# Altium project KlusterLab r2.0.PrjPcb (part 2 of 10)

## Sheet DDR3 Memory_Banks 32-33-34.SchDoc
size A3; SheetNumber: 5; SheetTotal: 23
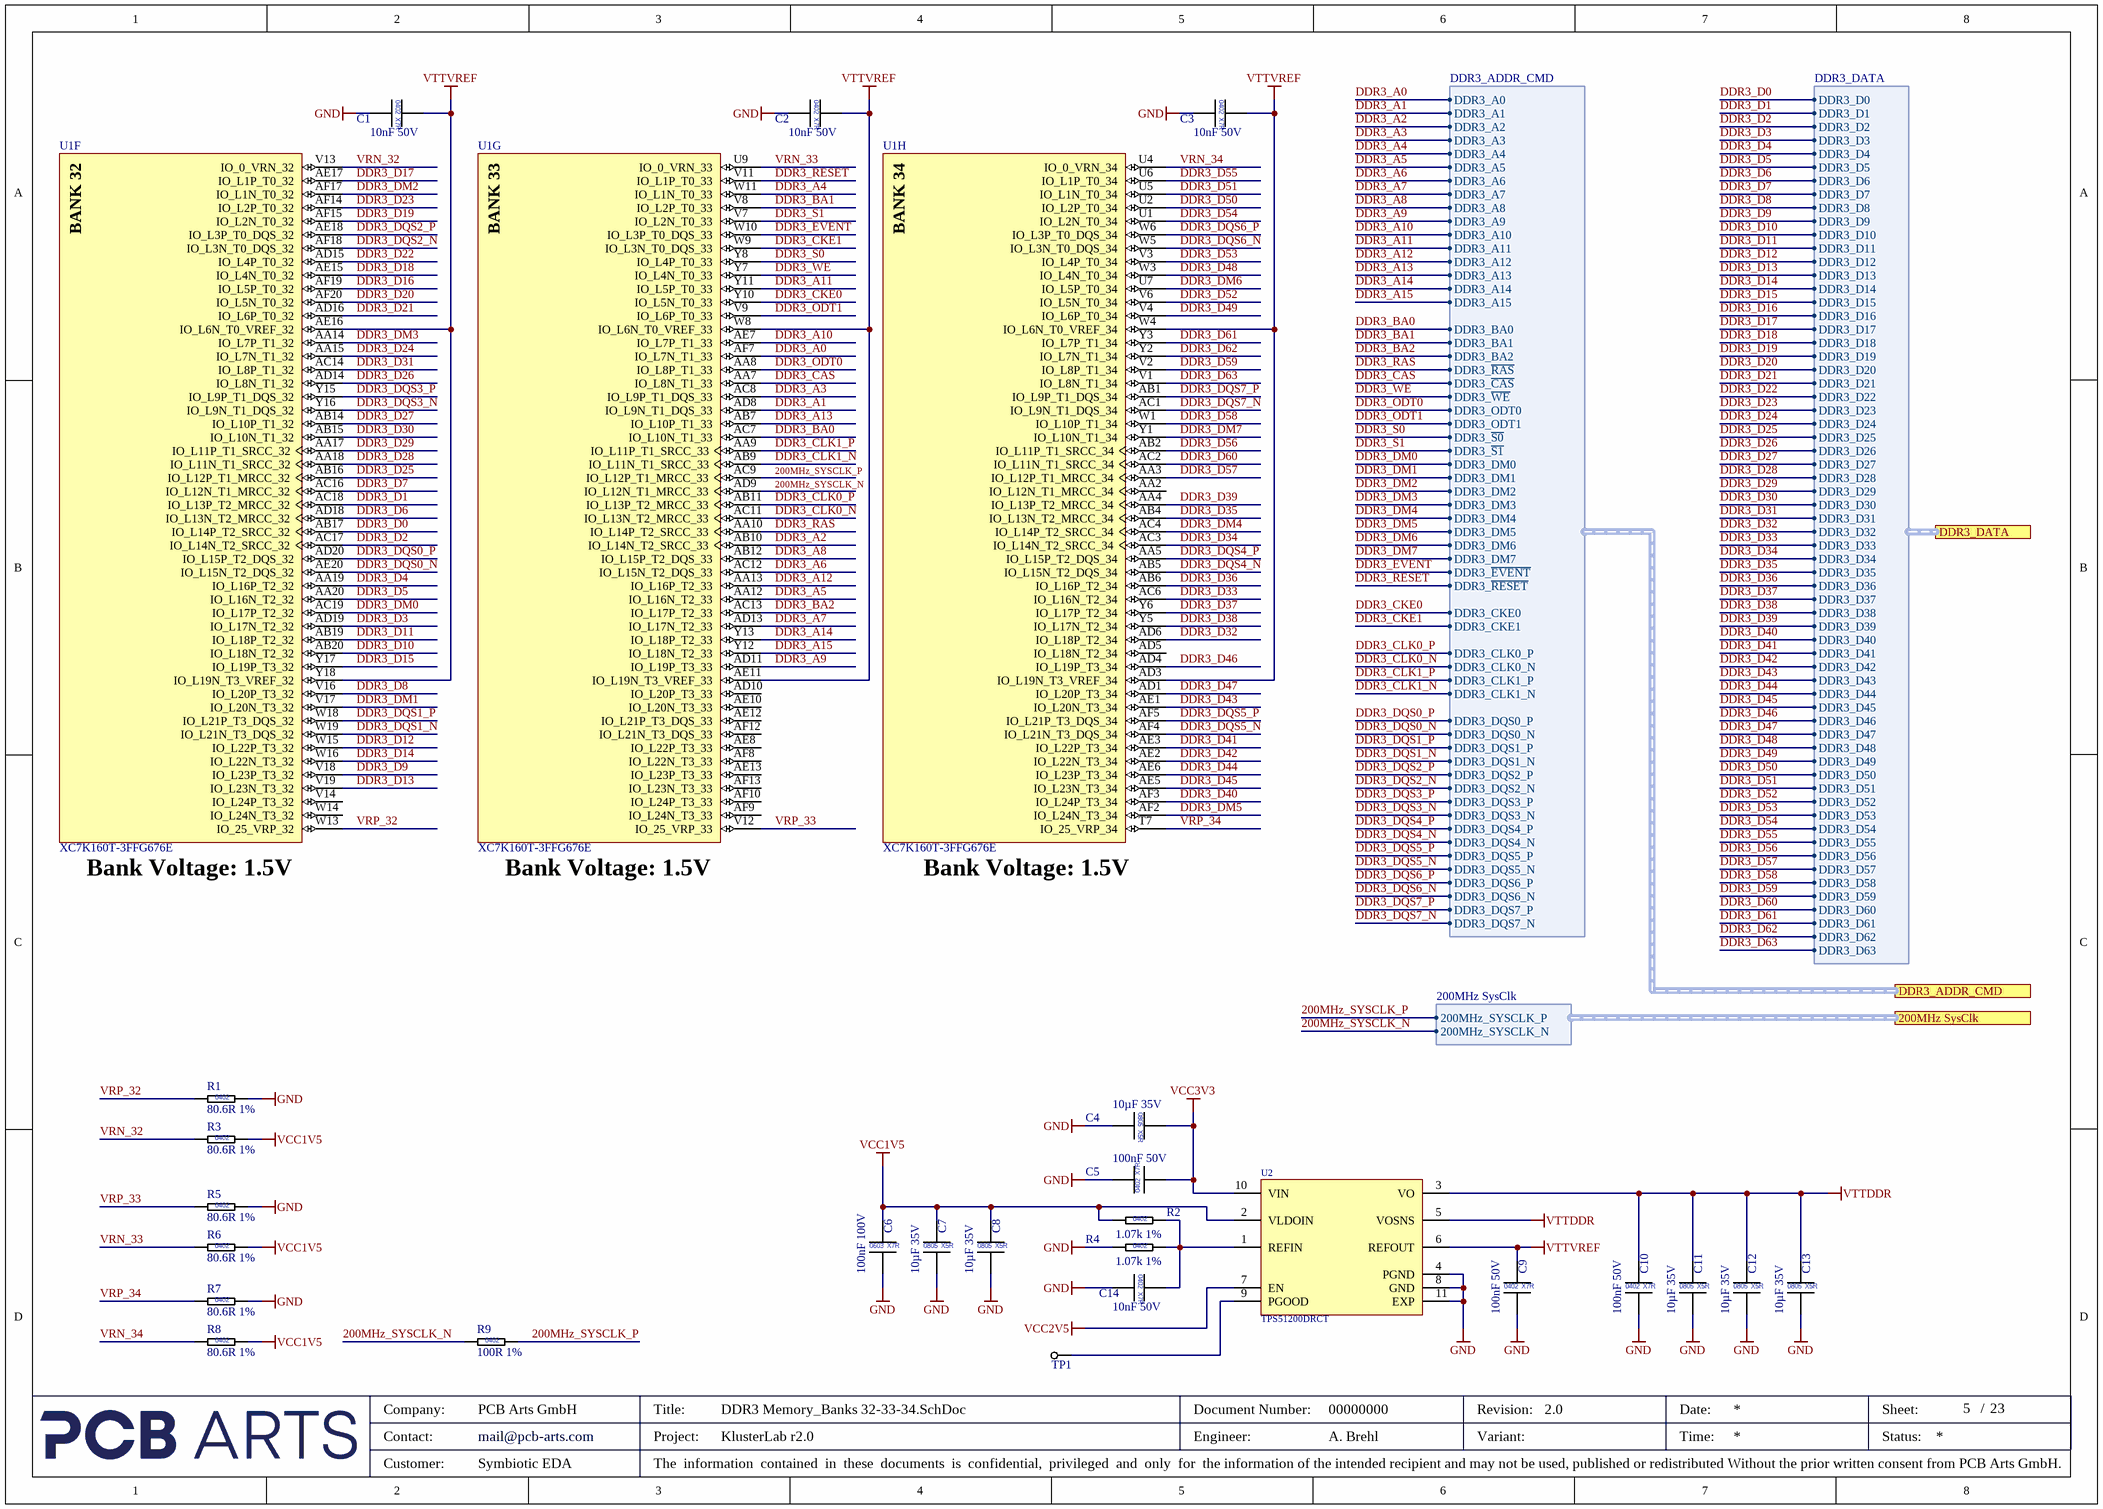
[diagram p3: DDR3 Memory_Banks 32-33-34.SchDoc]

### Parts
C1  10nF 50V  [CAP_0402_L]
C2  10nF 50V  [CAP_0402_L]
C3  10nF 50V  [CAP_0402_L]
C4  10µF 35V  [CAP_0805]
C5  100nF 50V  [CAP_0402_L]
C6  100nF 100V  [CAP_0603_L]
C7  10µF 35V  [CAP_0805]
C8  10µF 35V  [CAP_0805]
C9  100nF 50V  [CAP_0402_L]
C10  100nF 50V  [CAP_0402_L]
C11  10µF 35V  [CAP_0805]
C12  10µF 35V  [CAP_0805]
C13  10µF 35V  [CAP_0805]
C14  10nF 50V  [CAP_0402_L]
R1  80.6R 1%  [RES_0402_L]
R2  1.07k 1%  [RES_0402_L]
R3  80.6R 1%  [RES_0402_L]
R4  1.07k 1%  [RES_0402_L]
R5  80.6R 1%  [RES_0402_L]
R6  80.6R 1%  [RES_0402_L]
R7  80.6R 1%  [RES_0402_L]
R8  80.6R 1%  [RES_0402_L]
R9  100R 1%  [RES_0402_L]
TP1  Testpoint  [Testpoint 0.8mm]  (value not drawn)  (no BOM)
U1  XC7K160T-3FFG676E  [BGA100P2700X2700X317-676N]  (parts F,G,H of 14)
U2  TPS51200DRCT  [QFN50P300X300X100-11N]

### Ports
200MHz SysClk (harness 200MHz SysClk, see Top-Level-Sheet[5B], System Clocks[8A]), DDR3_ADDR_CMD (harness DDR3_ADDR_CMD, see Top-Level-Sheet[5B], DDR3 Memory_SO-DIMM[8C]), DDR3_DATA (harness DDR3_DATA, see Top-Level-Sheet[5B], DDR3 Memory_SO-DIMM[8B])

### Harnesses
DDR3_DATA: DDR3_D0, DDR3_D1, DDR3_D2, DDR3_D3, DDR3_D4, DDR3_D5, DDR3_D6, DDR3_D7, DDR3_D8, DDR3_D9, DDR3_D10, DDR3_D11, DDR3_D12, DDR3_D13, DDR3_D14, DDR3_D15, DDR3_D16, DDR3_D17, DDR3_D18, DDR3_D19, DDR3_D20, DDR3_D21, DDR3_D22, DDR3_D23, DDR3_D24, DDR3_D25, DDR3_D26, DDR3_D27, DDR3_D28, DDR3_D29, DDR3_D30, DDR3_D31, DDR3_D32, DDR3_D33, DDR3_D34, DDR3_D35, DDR3_D36, DDR3_D37, DDR3_D38, DDR3_D39, DDR3_D40, DDR3_D41, DDR3_D42, DDR3_D43, DDR3_D44, DDR3_D45, DDR3_D46, DDR3_D47, DDR3_D48, DDR3_D49, DDR3_D50, DDR3_D51, DDR3_D52, DDR3_D53, DDR3_D54, DDR3_D55, DDR3_D56, DDR3_D57, DDR3_D58, DDR3_D59, DDR3_D60, DDR3_D61, DDR3_D62, DDR3_D63
DDR3_ADDR_CMD: DDR3_A0, DDR3_BA0, DDR3_BA1, DDR3_BA2, DDR3_~{RAS}, DDR3_~{CAS}, DDR3_~{WE}, DDR3_ODT0, DDR3_ODT1, DDR3_~{S0}, DDR3_~{S1}, DDR3_DM0, DDR3_~{EVENT}, DDR3_~{RESET}, DDR3_CKE0, DDR3_CKE1, DDR3_CLK0_P, DDR3_CLK0_N, DDR3_CLK1_P, DDR3_CLK1_N, DDR3_DQS0_P, DDR3_DQS0_N, DDR3_DQS1_P, DDR3_DQS1_N, DDR3_DQS2_P, DDR3_DQS2_N, DDR3_DQS3_P, DDR3_DQS3_N, DDR3_DQS4_P, DDR3_DQS4_N, DDR3_DQS5_P, DDR3_DQS5_N, DDR3_DQS6_P, DDR3_DQS6_N, DDR3_DQS7_P, DDR3_DQS7_N, DDR3_A1, DDR3_A2, DDR3_A3, DDR3_A4, DDR3_A5, DDR3_A6, DDR3_A7, DDR3_A8, DDR3_A9, DDR3_A10, DDR3_A11, DDR3_A12, DDR3_A13, DDR3_A14, DDR3_A15, DDR3_DM1, DDR3_DM2, DDR3_DM3, DDR3_DM4, DDR3_DM5, DDR3_DM6, DDR3_DM7
200MHz SysClk: 200MHz_SYSCLK_P, 200MHz_SYSCLK_N

### Nets
GND: C1.2 C2.2 C3.2 C4.2 C5.1 C6.2 C7.2 C8.2 C9.2 C10.2 C11.2 C12.2 C13.2 C14.2 R1.2 R4.1 R5.2 R7.2 U2.4(PGND) U2.8(GND) U2.11(EXP)
VCC1V5: C6.1 C7.1 C8.1 R2.1 R3.2 R6.2 R8.2 U2.2(VLDOIN)
VCC2V5: U2.7(EN)
VCC3V3: C4.1 C5.2 U2.10(VIN)
VTTDDR: C10.1 C11.1 C12.1 C13.1 U2.3(VO) U2.5(VOSNS)
VTTVREF: C1.1 C2.1 C3.1 C9.1 U1.AD3(IO_L19N_T3_VREF_34) U1.AE11(IO_L19N_T3_VREF_33) U1.AE16(IO_L6N_T0_VREF_32) U1.W4(IO_L6N_T0_VREF_34) U1.W8(IO_L6N_T0_VREF_33) U1.Y18(IO_L19N_T3_VREF_32) U2.6(REFOUT)
200MHz_SYSCLK_N: R9.1 U1.AD9(IO_L12N_T1_MRCC_33) ; port 200MHz SysClk.200MHz_SYSCLK_N
200MHz_SYSCLK_P: R9.2 U1.AC9(IO_L12P_T1_MRCC_33) ; port 200MHz SysClk.200MHz_SYSCLK_P
DDR3_A0: U1.AF7(IO_L7N_T1_33) ; port DDR3_ADDR_CMD.DDR3_A0
DDR3_A1: U1.AD8(IO_L9N_T1_DQS_33) ; port DDR3_ADDR_CMD.DDR3_A1
DDR3_A2: U1.AB10(IO_L14N_T2_SRCC_33) ; port DDR3_ADDR_CMD.DDR3_A2
DDR3_A3: U1.AC8(IO_L9P_T1_DQS_33) ; port DDR3_ADDR_CMD.DDR3_A3
DDR3_A4: U1.W11(IO_L1N_T0_33) ; port DDR3_ADDR_CMD.DDR3_A4
DDR3_A5: U1.AA12(IO_L16N_T2_33) ; port DDR3_ADDR_CMD.DDR3_A5
DDR3_A6: U1.AC12(IO_L15N_T2_DQS_33) ; port DDR3_ADDR_CMD.DDR3_A6
DDR3_A7: U1.AD13(IO_L17N_T2_33) ; port DDR3_ADDR_CMD.DDR3_A7
DDR3_A8: U1.AB12(IO_L15P_T2_DQS_33) ; port DDR3_ADDR_CMD.DDR3_A8
DDR3_A9: U1.AD11(IO_L19P_T3_33) ; port DDR3_ADDR_CMD.DDR3_A9
DDR3_A10: U1.AE7(IO_L7P_T1_33) ; port DDR3_ADDR_CMD.DDR3_A10
DDR3_A11: U1.Y11(IO_L5P_T0_33) ; port DDR3_ADDR_CMD.DDR3_A11
DDR3_A12: U1.AA13(IO_L16P_T2_33) ; port DDR3_ADDR_CMD.DDR3_A12
DDR3_A13: U1.AB7(IO_L10P_T1_33) ; port DDR3_ADDR_CMD.DDR3_A13
DDR3_A14: U1.Y13(IO_L18P_T2_33) ; port DDR3_ADDR_CMD.DDR3_A14
DDR3_A15: U1.Y12(IO_L18N_T2_33) ; port DDR3_ADDR_CMD.DDR3_A15
DDR3_BA0: U1.AC7(IO_L10N_T1_33) ; port DDR3_ADDR_CMD.DDR3_BA0
DDR3_BA1: U1.V8(IO_L2P_T0_33) ; port DDR3_ADDR_CMD.DDR3_BA1
DDR3_BA2: U1.AC13(IO_L17P_T2_33) ; port DDR3_ADDR_CMD.DDR3_BA2
DDR3_~{CAS}: U1.AA7(IO_L8N_T1_33) ; port DDR3_ADDR_CMD.DDR3_~{CAS}
DDR3_CKE0: U1.Y10(IO_L5N_T0_33) ; port DDR3_ADDR_CMD.DDR3_CKE0
DDR3_CKE1: U1.W9(IO_L3N_T0_DQS_33) ; port DDR3_ADDR_CMD.DDR3_CKE1
DDR3_CLK0_N: U1.AC11(IO_L13N_T2_MRCC_33) ; port DDR3_ADDR_CMD.DDR3_CLK0_N
DDR3_CLK0_P: U1.AB11(IO_L13P_T2_MRCC_33) ; port DDR3_ADDR_CMD.DDR3_CLK0_P
DDR3_CLK1_N: U1.AB9(IO_L11N_T1_SRCC_33) ; port DDR3_ADDR_CMD.DDR3_CLK1_N
DDR3_CLK1_P: U1.AA9(IO_L11P_T1_SRCC_33) ; port DDR3_ADDR_CMD.DDR3_CLK1_P
DDR3_D0: U1.AB17(IO_L14P_T2_SRCC_32) ; port DDR3_DATA.DDR3_D0
DDR3_D1: U1.AC18(IO_L13P_T2_MRCC_32) ; port DDR3_DATA.DDR3_D1
DDR3_D2: U1.AC17(IO_L14N_T2_SRCC_32) ; port DDR3_DATA.DDR3_D2
DDR3_D3: U1.AD19(IO_L17N_T2_32) ; port DDR3_DATA.DDR3_D3
DDR3_D4: U1.AA19(IO_L16P_T2_32) ; port DDR3_DATA.DDR3_D4
DDR3_D5: U1.AA20(IO_L16N_T2_32) ; port DDR3_DATA.DDR3_D5
DDR3_D6: U1.AD18(IO_L13N_T2_MRCC_32) ; port DDR3_DATA.DDR3_D6
DDR3_D7: U1.AC16(IO_L12N_T1_MRCC_32) ; port DDR3_DATA.DDR3_D7
DDR3_D8: U1.V16(IO_L20P_T3_32) ; port DDR3_DATA.DDR3_D8
DDR3_D9: U1.V18(IO_L23P_T3_32) ; port DDR3_DATA.DDR3_D9
DDR3_D10: U1.AB20(IO_L18N_T2_32) ; port DDR3_DATA.DDR3_D10
DDR3_D11: U1.AB19(IO_L18P_T2_32) ; port DDR3_DATA.DDR3_D11
DDR3_D12: U1.W15(IO_L22P_T3_32) ; port DDR3_DATA.DDR3_D12
DDR3_D13: U1.V19(IO_L23N_T3_32) ; port DDR3_DATA.DDR3_D13
DDR3_D14: U1.W16(IO_L22N_T3_32) ; port DDR3_DATA.DDR3_D14
DDR3_D15: U1.Y17(IO_L19P_T3_32) ; port DDR3_DATA.DDR3_D15
DDR3_D16: U1.AF19(IO_L5P_T0_32) ; port DDR3_DATA.DDR3_D16
DDR3_D17: U1.AE17(IO_L1P_T0_32) ; port DDR3_DATA.DDR3_D17
DDR3_D18: U1.AE15(IO_L4N_T0_32) ; port DDR3_DATA.DDR3_D18
DDR3_D19: U1.AF15(IO_L2N_T0_32) ; port DDR3_DATA.DDR3_D19
DDR3_D20: U1.AF20(IO_L5N_T0_32) ; port DDR3_DATA.DDR3_D20
DDR3_D21: U1.AD16(IO_L6P_T0_32) ; port DDR3_DATA.DDR3_D21
DDR3_D22: U1.AD15(IO_L4P_T0_32) ; port DDR3_DATA.DDR3_D22
DDR3_D23: U1.AF14(IO_L2P_T0_32) ; port DDR3_DATA.DDR3_D23
DDR3_D24: U1.AA15(IO_L7N_T1_32) ; port DDR3_DATA.DDR3_D24
DDR3_D25: U1.AB16(IO_L12P_T1_MRCC_32) ; port DDR3_DATA.DDR3_D25
DDR3_D26: U1.AD14(IO_L8N_T1_32) ; port DDR3_DATA.DDR3_D26
DDR3_D27: U1.AB14(IO_L10P_T1_32) ; port DDR3_DATA.DDR3_D27
DDR3_D28: U1.AA18(IO_L11N_T1_SRCC_32) ; port DDR3_DATA.DDR3_D28
DDR3_D29: U1.AA17(IO_L11P_T1_SRCC_32) ; port DDR3_DATA.DDR3_D29
DDR3_D30: U1.AB15(IO_L10N_T1_32) ; port DDR3_DATA.DDR3_D30
DDR3_D31: U1.AC14(IO_L8P_T1_32) ; port DDR3_DATA.DDR3_D31
DDR3_D32: U1.AD6(IO_L18P_T2_34) ; port DDR3_DATA.DDR3_D32
DDR3_D33: U1.AC6(IO_L16N_T2_34) ; port DDR3_DATA.DDR3_D33
DDR3_D34: U1.AC3(IO_L14N_T2_SRCC_34) ; port DDR3_DATA.DDR3_D34
DDR3_D35: U1.AB4(IO_L13N_T2_MRCC_34) ; port DDR3_DATA.DDR3_D35
DDR3_D36: U1.AB6(IO_L16P_T2_34) ; port DDR3_DATA.DDR3_D36
DDR3_D37: U1.Y6(IO_L17P_T2_34) ; port DDR3_DATA.DDR3_D37
DDR3_D38: U1.Y5(IO_L17N_T2_34) ; port DDR3_DATA.DDR3_D38
DDR3_D39: U1.AA4(IO_L13P_T2_MRCC_34) ; port DDR3_DATA.DDR3_D39
DDR3_D40: U1.AF3(IO_L24P_T3_34) ; port DDR3_DATA.DDR3_D40
DDR3_D41: U1.AE3(IO_L22P_T3_34) ; port DDR3_DATA.DDR3_D41
DDR3_D42: U1.AE2(IO_L22N_T3_34) ; port DDR3_DATA.DDR3_D42
DDR3_D43: U1.AE1(IO_L20N_T3_34) ; port DDR3_DATA.DDR3_D43
DDR3_D44: U1.AE6(IO_L23P_T3_34) ; port DDR3_DATA.DDR3_D44
DDR3_D45: U1.AE5(IO_L23N_T3_34) ; port DDR3_DATA.DDR3_D45
DDR3_D46: U1.AD4(IO_L19P_T3_34) ; port DDR3_DATA.DDR3_D46
DDR3_D47: U1.AD1(IO_L20P_T3_34) ; port DDR3_DATA.DDR3_D47
DDR3_D48: U1.W3(IO_L4N_T0_34) ; port DDR3_DATA.DDR3_D48
DDR3_D49: U1.V4(IO_L6P_T0_34) ; port DDR3_DATA.DDR3_D49
DDR3_D50: U1.U2(IO_L2P_T0_34) ; port DDR3_DATA.DDR3_D50
DDR3_D51: U1.U5(IO_L1N_T0_34) ; port DDR3_DATA.DDR3_D51
DDR3_D52: U1.V6(IO_L5N_T0_34) ; port DDR3_DATA.DDR3_D52
DDR3_D53: U1.V3(IO_L4P_T0_34) ; port DDR3_DATA.DDR3_D53
DDR3_D54: U1.U1(IO_L2N_T0_34) ; port DDR3_DATA.DDR3_D54
DDR3_D55: U1.U6(IO_L1P_T0_34) ; port DDR3_DATA.DDR3_D55
DDR3_D56: U1.AB2(IO_L11P_T1_SRCC_34) ; port DDR3_DATA.DDR3_D56
DDR3_D57: U1.AA3(IO_L12P_T1_MRCC_34) ; port DDR3_DATA.DDR3_D57
DDR3_D58: U1.W1(IO_L10P_T1_34) ; port DDR3_DATA.DDR3_D58
DDR3_D59: U1.V2(IO_L8P_T1_34) ; port DDR3_DATA.DDR3_D59
DDR3_D60: U1.AC2(IO_L11N_T1_SRCC_34) ; port DDR3_DATA.DDR3_D60
DDR3_D61: U1.Y3(IO_L7P_T1_34) ; port DDR3_DATA.DDR3_D61
DDR3_D62: U1.Y2(IO_L7N_T1_34) ; port DDR3_DATA.DDR3_D62
DDR3_D63: U1.V1(IO_L8N_T1_34) ; port DDR3_DATA.DDR3_D63
DDR3_DM0: U1.AC19(IO_L17P_T2_32) ; port DDR3_ADDR_CMD.DDR3_DM0
DDR3_DM1: U1.V17(IO_L20N_T3_32) ; port DDR3_ADDR_CMD.DDR3_DM1
DDR3_DM2: U1.AF17(IO_L1N_T0_32) ; port DDR3_ADDR_CMD.DDR3_DM2
DDR3_DM3: U1.AA14(IO_L7P_T1_32) ; port DDR3_ADDR_CMD.DDR3_DM3
DDR3_DM4: U1.AC4(IO_L14P_T2_SRCC_34) ; port DDR3_ADDR_CMD.DDR3_DM4
DDR3_DM5: U1.AF2(IO_L24N_T3_34) ; port DDR3_ADDR_CMD.DDR3_DM5
DDR3_DM6: U1.U7(IO_L5P_T0_34) ; port DDR3_ADDR_CMD.DDR3_DM6
DDR3_DM7: U1.Y1(IO_L10N_T1_34) ; port DDR3_ADDR_CMD.DDR3_DM7
DDR3_DQS0_N: U1.AE20(IO_L15N_T2_DQS_32) ; port DDR3_ADDR_CMD.DDR3_DQS0_N
DDR3_DQS0_P: U1.AD20(IO_L15P_T2_DQS_32) ; port DDR3_ADDR_CMD.DDR3_DQS0_P
DDR3_DQS1_N: U1.W19(IO_L21N_T3_DQS_32) ; port DDR3_ADDR_CMD.DDR3_DQS1_N
DDR3_DQS1_P: U1.W18(IO_L21P_T3_DQS_32) ; port DDR3_ADDR_CMD.DDR3_DQS1_P
DDR3_DQS2_N: U1.AF18(IO_L3N_T0_DQS_32) ; port DDR3_ADDR_CMD.DDR3_DQS2_N
DDR3_DQS2_P: U1.AE18(IO_L3P_T0_DQS_32) ; port DDR3_ADDR_CMD.DDR3_DQS2_P
DDR3_DQS3_N: U1.Y16(IO_L9N_T1_DQS_32) ; port DDR3_ADDR_CMD.DDR3_DQS3_N
DDR3_DQS3_P: U1.Y15(IO_L9P_T1_DQS_32) ; port DDR3_ADDR_CMD.DDR3_DQS3_P
DDR3_DQS4_N: U1.AB5(IO_L15N_T2_DQS_34) ; port DDR3_ADDR_CMD.DDR3_DQS4_N
DDR3_DQS4_P: U1.AA5(IO_L15P_T2_DQS_34) ; port DDR3_ADDR_CMD.DDR3_DQS4_P
DDR3_DQS5_N: U1.AF4(IO_L21N_T3_DQS_34) ; port DDR3_ADDR_CMD.DDR3_DQS5_N
DDR3_DQS5_P: U1.AF5(IO_L21P_T3_DQS_34) ; port DDR3_ADDR_CMD.DDR3_DQS5_P
DDR3_DQS6_N: U1.W5(IO_L3N_T0_DQS_34) ; port DDR3_ADDR_CMD.DDR3_DQS6_N
DDR3_DQS6_P: U1.W6(IO_L3P_T0_DQS_34) ; port DDR3_ADDR_CMD.DDR3_DQS6_P
DDR3_DQS7_N: U1.AC1(IO_L9N_T1_DQS_34) ; port DDR3_ADDR_CMD.DDR3_DQS7_N
DDR3_DQS7_P: U1.AB1(IO_L9P_T1_DQS_34) ; port DDR3_ADDR_CMD.DDR3_DQS7_P
DDR3_~{EVENT}: U1.W10(IO_L3P_T0_DQS_33) ; port DDR3_ADDR_CMD.DDR3_~{EVENT}
DDR3_ODT0: U1.AA8(IO_L8P_T1_33) ; port DDR3_ADDR_CMD.DDR3_ODT0
DDR3_ODT1: U1.V9(IO_L6P_T0_33) ; port DDR3_ADDR_CMD.DDR3_ODT1
DDR3_~{RAS}: U1.AA10(IO_L14P_T2_SRCC_33) ; port DDR3_ADDR_CMD.DDR3_~{RAS}
DDR3_~{RESET}: U1.V11(IO_L1P_T0_33) ; port DDR3_ADDR_CMD.DDR3_~{RESET}
DDR3_~{S0}: U1.Y8(IO_L4P_T0_33) ; port DDR3_ADDR_CMD.DDR3_~{S0}
DDR3_~{S1}: U1.V7(IO_L2N_T0_33) ; port DDR3_ADDR_CMD.DDR3_~{S1}
DDR3_~{WE}: U1.Y7(IO_L4N_T0_33) ; port DDR3_ADDR_CMD.DDR3_~{WE}
VRN_32: R3.1 U1.V13(IO_0_VRN_32)
VRN_33: R6.1 U1.U9(IO_0_VRN_33)
VRN_34: R8.1 U1.U4(IO_0_VRN_34)
VRP_32: R1.1 U1.W13(IO_25_VRP_32)
VRP_33: R5.1 U1.V12(IO_25_VRP_33)
VRP_34: R7.1 U1.T7(IO_25_VRP_34)
NetC14_1: C14.1 R2.2 R4.2 U2.1(REFIN)
NetTP1_1: TP1.1(GND) U2.9(PGOOD)

Not connected (* = marked no-connect by the designer): U1 AA2(IO_L12N_T1_MRCC_34) AD5(IO_L18N_T2_34) AD10(IO_L20P_T3_33) AE8(IO_L22P_T3_33) AE10(IO_L20N_T3_33) AE12(IO_L21P_T3_DQS_33) AE13(IO_L23P_T3_33) AF8(IO_L22N_T3_33) AF9(IO_L24N_T3_33) AF10(IO_L24P_T3_33) AF12(IO_L21N_T3_DQS_33) AF13(IO_L23N_T3_33) V14(IO_L24P_T3_32) W14(IO_L24N_T3_32)

### Notes on the sheet
- (near U1) Bank Voltage: 1.5V
- Company:
- Contact:
- Customer:
- mail@pcb-arts.com
- PCB Arts GmbH
- Title:
- Project:
- The  information  contained  in  these  documents  is  confidential,  privileged  and  only  for  the information of the intended recipient and may not be used, published or redistributed Without the prior written consent from PCB Arts GmbH.
- Engineer:
- Document Number:
- Revision:
- Variant:
- Date:
- Time:
- Sheet:
- Status:
- /
- (in symbol CAP_0402_10nF_50V) 0402; X7R
- (in symbol CAP_0402_100nF_50V) 0402; X7R
- (in symbol CAP_0603_100nF_100V) 0603; X7R
- (in symbol CAP_0805_10µF_35V) 0805; X5R
- (in symbol RES_0402_1.07k_1%) 0402
- (in symbol RES_0402_80.6R_1%) 0402
- (in symbol RES_0402_100R_1%) 0402
- (in symbol XC7K160T-3FFG676E_Kintex-7 FPGA, 400 User I/Os, 8 GTX, FFG676, part F) BANK 32
- (in symbol XC7K160T-3FFG676E_Kintex-7 FPGA, 400 User I/Os, 8 GTX, FFG676, part G) BANK 33
- (in symbol XC7K160T-3FFG676E_Kintex-7 FPGA, 400 User I/Os, 8 GTX, FFG676, part H) BANK 34

### Library data of the parts
C1-C3 C14 = CAP_0402_10nF_50V: Multilayer Ceramic Capacitors MLCC - SMD/SMT 0402 50VDC; Manufacturer 1: Wurth Elektronik; Manufacturer 1 Prt. Nr.: 885012205067; Manufacturer 2 Prt. Nr.: AC0402KPX7R9BB103; Manufacturer 2: Yageo
C4 C7 C8 C11-C13 = CAP_0805_10µF_35V: Multilayer Ceramic Capacitors MLCC - SMD/SMT 0805 35VDC; Manufacturer 1: Murata Electronics; Manufacturer 1 Prt. Nr.: GRM21BR6YA106ME43L; Manufacturer 2 Prt. Nr.: C2012X5R1V106M085AC; Manufacturer 2: TDK
C5 C9 C10 = CAP_0402_100nF_50V: as C147 on sheet Bank 0_Bank 14; Manufacturer 2: TDK
C6 = CAP_0603_100nF_100V: Multilayer Ceramic Capacitors MLCC - SMD/SMT 0603 100VDC; Manufacturer 1: Samsung Electro-Mechanics; Manufacturer 1 Prt. Nr.: CL10B104KC8NNNC; Manufacturer 2 Prt. Nr.: 06031C104KAT2A; Manufacturer 2: AVX
R1 R3 R5-R8 = RES_0402_80.6R_1%: Thick Film Resistors - SMD 80.6R 1%; Manufacturer 1: Vishay / Dale; Manufacturer 1 Prt. Nr.: CRCW040280R6FKEDC; Manufacturer 2 Prt. Nr.: RC0402FR-7W80R6L; Manufacturer 2: Yageo
R2 R4 = RES_0402_1.07k_1%: Thick Film Resistors - SMD 1.07kOhm 1%; Manufacturer 1: Vishay / Dale; Manufacturer 1 Prt. Nr.: CRCW04021K07FKEDC; Manufacturer 2 Prt. Nr.: AC0402FR-071K07L; Manufacturer 2: Yageo
R9 = RES_0402_100R_1%: as R109 on sheet Bank 0_Bank 14; Manufacturer 2: Yageo
TP1 = Testpoint 0.8mm
U1 = XC7K160T-3FFG676E_Kintex-7 FPGA, 400 User I/Os, 8 GTX, FFG676: as U1 on sheet Bank 0_Bank 14; Manufacturer 1 Prt. Nr.: XC7K160T-3FFG676E; ComponentLink1URL: http://www.xilinx.com/support/documentation/data_sheets/ds180_7Series_Overview.pdf; ComponentLink2URL: http://www.xilinx.com/support/documentation/user_guides/ug865-Zynq-7000-Pkg-Pinout.pdf; ComponentLink1Description: Datasheet; ComponentLink2Description: Package Specification
U2 = TPS51200DRCT_Sink and Source DDR Termination Regulator: Sink and Source DDR Termination Regulator; Manufacturer 1: Texas Instruments; Manufacturer 1 Prt. Nr.: TPS51200DRCT